# Altium schematic sheet Relay4_Block.SchDoc
size A4; CheckedBy: CT-Energys; Author: CT-Energys; CompanyName: HTD COMPANY LIMITED; DrawnBy: CHITOAN; Engineer: CHITOAN; Organization: Altium Limited; Address1: HO CHI MINH CITY; Address2: VIETNAM
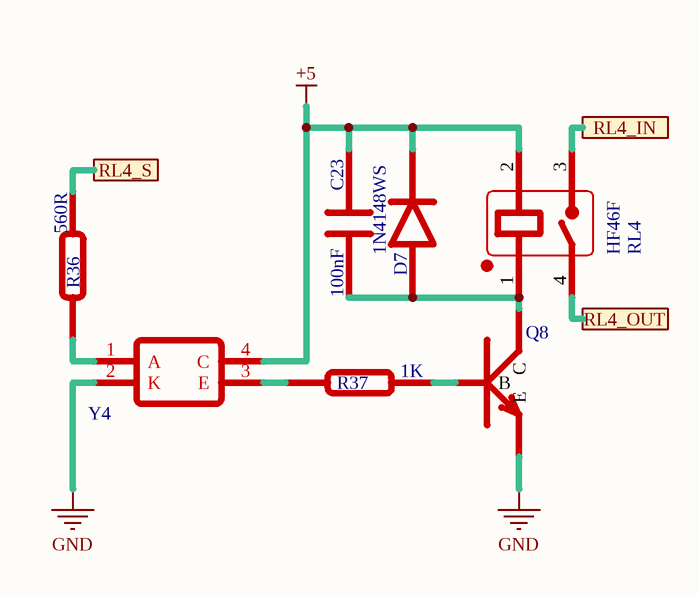
[diagram p0: Relay4_Block.SchDoc]

## Parts
C23  100nF  [C0805]
D7  1N4148WS  [SMA]
Q8  S8050  [SOT-23]  (value not drawn)
R36  560R  [R0603]
R37  1K  [R0603]
RL4  HF46F  [HF-46-X]
Y4  PHOTOCOUPLER  [SOP-4]  (value not drawn)

## Ports
RL4_IN, RL4_OUT, RL4_S

## Nets
+5: C23.2 D7.K RL4.2 Y4.4(C)
GND: Q8.2(E) Y4.2(K)
RL4_IN: RL4.3 ; port RL4_IN
RL4_OUT: RL4.4 ; port RL4_OUT
RL4_S: R36.1 ; port RL4_S
NetC23_1: C23.1 D7.A Q8.3(C) RL4.1
NetQ8_1: Q8.1(B) R37.1
NetR36_2: R36.2 Y4.1(A)
NetR37_2: R37.2 Y4.3(E)

## Notes on the sheet
- Title
- Size:
- Date:
- A4
- Number:
- Time:
- Revision:
- Design by:
- Company:
- File:

## Library data of the parts
C23 = CAP-CER: Ceramic Capacitor
D7 = 1N4148WS: Small Signal Diode
Q8 = S8050: NPN Transistors 0.5A Collector to Emitter 25V
R36 R37 = Resistor
RL4 = HF46F: Relay 4 Pin; ComponentLink1Description: HF-46F; ComponentLink1URL: https://source.hongfa.com/pdf/web/viewer.html?file=/Uploads/Product/PDF/HF46F_en.pdf
Y4 = PC817: Photo-Coupler; ComponentLink1Description: PC817; ComponentLink1URL: https://www.socle-tech.com/doc/IC%20Channel%20Product/Optoelectronic%20Components/Photocoupler/PC8171_NIP1B_ED-16P023.pdf